# Altium schematic sheet Main.SchDoc
size A4; SheetNumber: 1; SheetTotal: 2
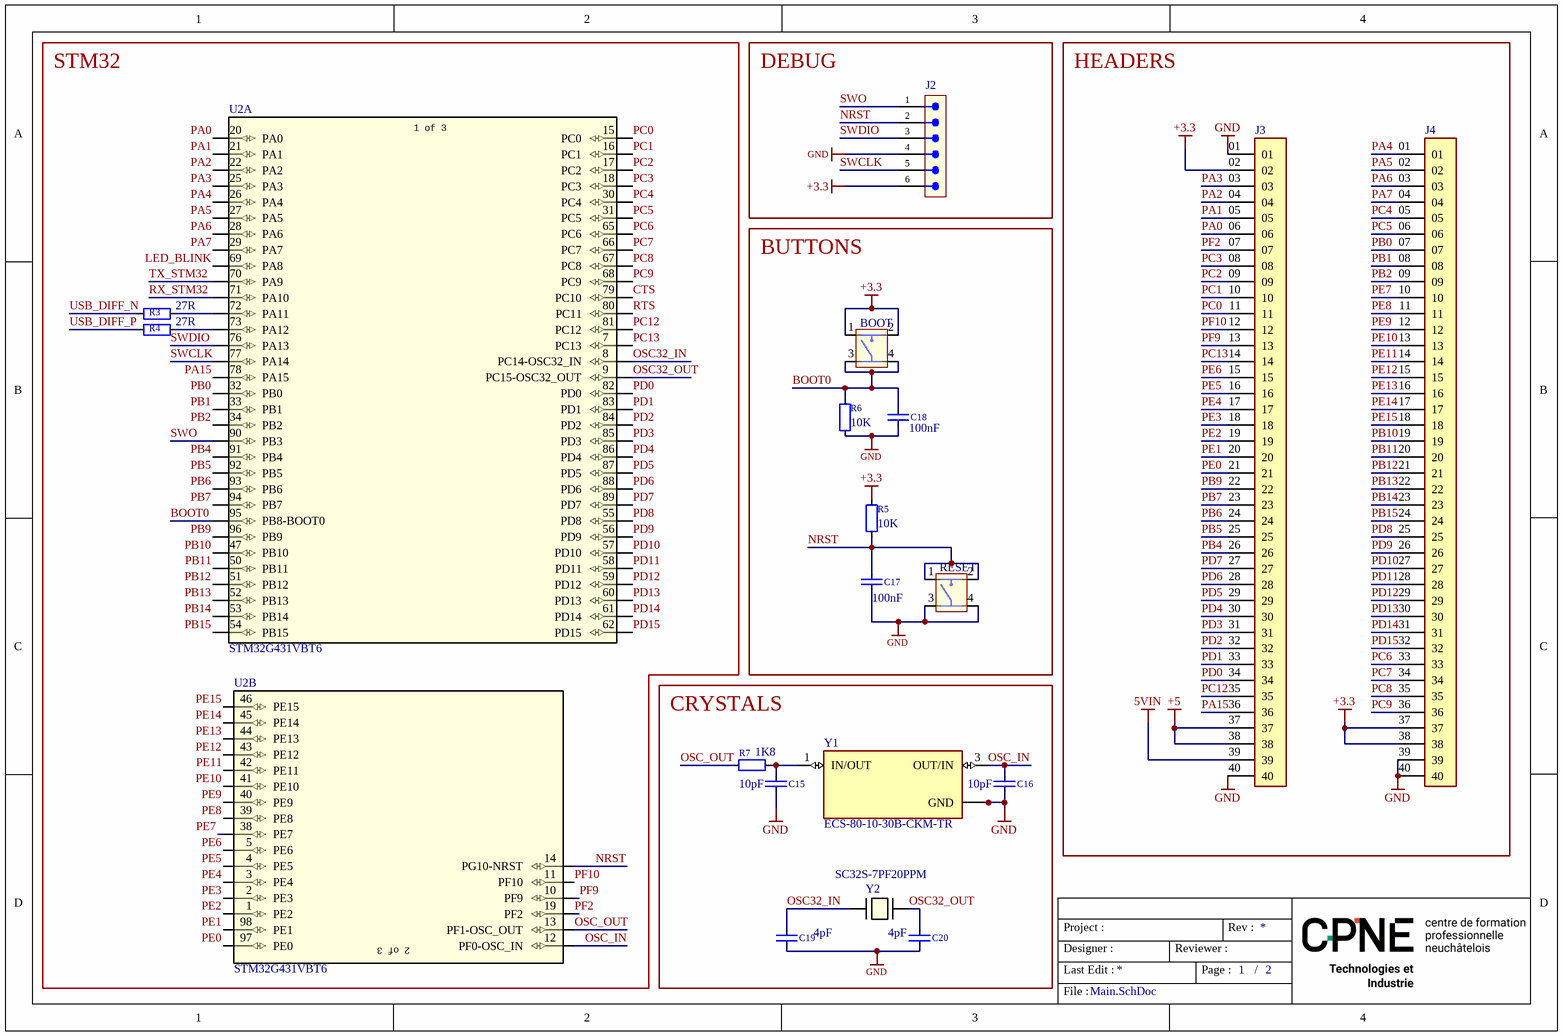
[diagram p0: Main.SchDoc]

## Parts
BOOT  PTS645SH43SMTR92 LFS  [PTS645SH43SMTR92 LFS]  (value not drawn)
C15  Displayed Value: 10pF  [WCAP-CSGP_0603_L1.6W0.8H0.8_Reflow]  (hidden comment: C_0603_10pF_50V)
C16  Displayed Value: 10pF  [WCAP-CSGP_0603_L1.6W0.8H0.8_Reflow]  (hidden comment: C_0603_10pF_50V)
C17  Displayed Value: 100nF  [SMD_0805_footprint]  (hidden comment: C_0805_100n0_X7R)
C18  Displayed Value: 100nF  [SMD_0805_footprint]  (hidden comment: C_0805_100n0_X7R)
C19  Displayed Value: 4pF  [WCAP-CSGP_0603_L1.6W0.8H0.8_Reflow]  (hidden comment: C_0603_4pF_50V)
C20  Displayed Value: 4pF  [WCAP-CSGP_0603_L1.6W0.8H0.8_Reflow]  (hidden comment: C_0603_4pF_50V)
J2  THT 1-Row Vertical Pin Header, 6 Pins, Pitch 2.54mm  [61300611121]  (value not drawn)
J3  THT 1-Row Vertical Pin Header, 40 Pins, Pitch 2.54mm  [THT 1-Row Vertical Pin Header, 40 Pins, Pitch 2.54mm]  (value not drawn)
J4  THT 1-Row Vertical Pin Header, 40 Pins, Pitch 2.54mm  [THT 1-Row Vertical Pin Header, 40 Pins, Pitch 2.54mm]  (value not drawn)
R3  Displayed Value: 27R  [SMD_0805_footprint]  (hidden comment: R_0805_27R0)
R4  Displayed Value: 27R  [SMD_0805_footprint]  (hidden comment: R_0805_27R0)
R5  Displayed Value: 10K  [SMD_0805_footprint]  (hidden comment: R_0805_10K_0.125W)
R6  Displayed Value: 10K  [SMD_0805_footprint]  (hidden comment: R_0805_10K_0.125W)
R7  Displayed Value: 1K8  [SMD_0805_footprint]  (hidden comment: R_0805_1K80)
RESET  PTS645SH43SMTR92 LFS  [PTS645SH43SMTR92 LFS]  (value not drawn)
U2  STM32G431VBT6  [LQFP100]  (parts A,B of 3)
Y1  ECS-80-10-30B-CKM-TR  [ECS-80-10-30B-CKM-TR]
Y2  SC32S-7PF20PPM  [SC32S-7PF20PPM-Footprint-1]

## Blocks framed on the sheet
STM32: R3 R4 U2
DEBUG: J2
HEADERS: J3 J4
BUTTONS: BOOT C17 C18 R5 R6 RESET
CRYSTALS: C15 C16 C19 C20 R7 Y1 Y2

## Nets
5VIN: J3.39
+3.3: BOOT.1 BOOT.2 J2.6 J3.02 J4.37 J4.38 R5.2
+5: J3.37 J3.38
GND: C15.1 C16.1 C17.1 C18.1 C19.1 C20.1 J2.4 J3.01 J3.40 J4.39 J4.40 R6.1 RESET.3 RESET.4 Y1.2(GND) Y1.4(GND)
BOOT0: BOOT.3 BOOT.4 C18.2 R6.2 U2.95(PB8-BOOT0)
CTS: U2.79(PC10)
LED_BLINK: U2.69(PA8)
NRST: C17.2 J2.2 R5.1 RESET.1 RESET.2 U2.14(PG10-NRST)
OSC32_IN: C19.2 U2.8(PC14-OSC32_IN) Y2.1
OSC32_OUT: C20.2 U2.9(PC15-OSC32_OUT) Y2.2
OSC_IN: C16.2 U2.12(PF0-OSC_IN) Y1.3(OUT/IN)
OSC_OUT: R7.1 U2.13(PF1-OSC_OUT)
PA0: J3.06 U2.20(PA0)
PA1: J3.05 U2.21(PA1)
PA2: J3.04 U2.22(PA2)
PA3: J3.03 U2.25(PA3)
PA4: J4.01 U2.26(PA4)
PA5: J4.02 U2.27(PA5)
PA6: J4.03 U2.28(PA6)
PA7: J4.04 U2.29(PA7)
PA15: J3.36 U2.78(PA15)
PB0: J4.07 U2.32(PB0)
PB1: J4.08 U2.33(PB1)
PB2: J4.09 U2.34(PB2)
PB4: J3.26 U2.91(PB4)
PB5: J3.25 U2.92(PB5)
PB6: J3.24 U2.93(PB6)
PB7: J3.23 U2.94(PB7)
PB9: J3.22 U2.96(PB9)
PB10: J4.19 U2.47(PB10)
PB11: J4.20 U2.50(PB11)
PB12: J4.21 U2.51(PB12)
PB13: J4.22 U2.52(PB13)
PB14: J4.23 U2.53(PB14)
PB15: J4.24 U2.54(PB15)
PC0: J3.11 U2.15(PC0)
PC1: J3.10 U2.16(PC1)
PC2: J3.09 U2.17(PC2)
PC3: J3.08 U2.18(PC3)
PC4: J4.05 U2.30(PC4)
PC5: J4.06 U2.31(PC5)
PC6: J4.33 U2.65(PC6)
PC7: J4.34 U2.66(PC7)
PC8: J4.35 U2.67(PC8)
PC9: J4.36 U2.68(PC9)
PC12: J3.35 U2.81(PC12)
PC13: J3.14 U2.7(PC13)
PD0: J3.34 U2.82(PD0)
PD1: J3.33 U2.83(PD1)
PD2: J3.32 U2.84(PD2)
PD3: J3.31 U2.85(PD3)
PD4: J3.30 U2.86(PD4)
PD5: J3.29 U2.87(PD5)
PD6: J3.28 U2.88(PD6)
PD7: J3.27 U2.89(PD7)
PD8: J4.25 U2.55(PD8)
PD9: J4.26 U2.56(PD9)
PD10: J4.27 U2.57(PD10)
PD11: J4.28 U2.58(PD11)
PD12: J4.29 U2.59(PD12)
PD13: J4.30 U2.60(PD13)
PD14: J4.31 U2.61(PD14)
PD15: J4.32 U2.62(PD15)
PE0: J3.21 U2.97(PE0)
PE1: J3.20 U2.98(PE1)
PE2: J3.19 U2.1(PE2)
PE3: J3.18 U2.2(PE3)
PE4: J3.17 U2.3(PE4)
PE5: J3.16 U2.4(PE5)
PE6: J3.15 U2.5(PE6)
PE7: J4.10 U2.38(PE7)
PE8: J4.11 U2.39(PE8)
PE9: J4.12 U2.40(PE9)
PE10: J4.13 U2.41(PE10)
PE11: J4.14 U2.42(PE11)
PE12: J4.15 U2.43(PE12)
PE13: J4.16 U2.44(PE13)
PE14: J4.17 U2.45(PE14)
PE15: J4.18 U2.46(PE15)
PF2: J3.07 U2.19(PF2)
PF9: J3.13 U2.10(PF9)
PF10: J3.12 U2.11(PF10)
RTS: U2.80(PC11)
RX_STM32: U2.71(PA10)
SWCLK: J2.5 U2.77(PA14)
SWDIO: J2.3 U2.76(PA13)
SWO: J2.1 U2.90(PB3)
TX_STM32: U2.70(PA9)
USB_DIFF_N: R3.1
USB_DIFF_P: R4.1
NetC15_2: C15.2 R7.2 Y1.1(IN/OUT)
NetR3_2: R3.2 U2.72(PA11)
NetR4_2: R4.2 U2.73(PA12)

## Notes on the sheet
- Designer :
- Last Edit :
- Project :
- Reviewer :
- Page :
- Rev :
- /
- File :
- (in symbol CMP-00274-1, part A) 1 of 3
- (in symbol CMP-00274-1, part B) 2 of 3

## Library data of the parts
BOOT RESET = CMP-00294-6: SWITCH TACTILE SPST-NO 0.05A 12V; Manufacturer: E-Switch; Manufacturer Part Number: TL3301NF160QG-KR; Datasheet: chrome-extension://efaidnbmnnnibpcajpcglclefindmkaj/https://configured-product-images.s3.amazonaws.com/Datasheets/TL3301.pdf
C15 C16 = C_0603_-1: CAP CER 10PF 50V C0G/NP0 0603 / 10 pF ±5% 50V Ceramic Capacitor C0G, NP0 0603 (1608 Metric); Manufacturer Part Number: C0603C100J5GACTU; Manufacturer: Kemet
C17 C18 = CMP-00043-7: Ceramic Capacitor, Multilayer, Ceramic, 50V, 10% +Tol, 10% -Tol, X7R, 15% TC, 0.1uF, Surface Mount, 0805; Manufacturer Part Number: 885012207098; Manufacturer: Würth Elektronik
C19 C20 = CMP-00285-1: CAP CER 4PF 50V C0G/NP0 0603 / 10 pF ±5% 50V Ceramic Capacitor C0G, NP0 0603 (1608 Metric); Manufacturer Part Number: CC0603CRNPO9BN4R0; Manufacturer: Yageo
J2 = CMP-00286-1: THT Vertical Pin Header WR-PHD, Pitch 2.54mm, Single Row, 6 Pins; Manufacturer: Würth Elektronik; Manufacturer Part Number: 613 006 11121
J3 J4 = CMP-00295-3: THT Vertical Pin Header WR-PHD, Pitch 2.54mm, Single Row, 40 Pins; Manufacturer: Würth Elektronik; Manufacturer Part Number: 613 008 11121
R3 R4 = CMP-001-001-2: Res Thick Film 0805 27 Ohm 1% 0.125W ±100ppm/°C Molded SMD Punched Carrier T/R; Manufacturer Part Number: CRCW080527R0JNTA; Manufacturer: Panasonic
R5 R6 = CMP-067-000001-3: Res Thick Film 0805 10K Ohm 1% 0.125W(1/8W) ±100ppm/C Pad SMD Automotive T/R; Manufacturer Part Number: ERJ-6ENF1002V; Manufacturer: Panasonic
R7 = CMP-00088-2: Resistor 1K8, SMD 0805, 1% 0.125W; Manufacturer: Panasonic; Manufacturer Part Number: ERJ-6ENF1801V
U2 = CMP-00274-1: Microcontroller 32-Bit ARM Cortex-M4 RISC 128KB Flash 1.71V to 3.6V 100-Pin LQFP; Number of USART Channels: 3; Peripherals: POR; Operating Supply Voltage: 3V; Number of Interrupts: 16; Interface: UART, USB; Number of I/Os: 6; Number of Channels: 23; DAC Channels (Resolution): 4-Ch 12-Bit; ADC Channels (Resolution): 23-Ch 12-Bit; RAM Size: 32kB; Frequency: 170MHz; Number of D/A Converters: 2; Number of UART Channels: 1; Clock Frequency: 48MHz; EEPROM Memory Size: 0B; Max Supply Current: 29mA; Number of Timers/Counters: 12; Memory Format: FLASH; Width: 14mm; Height - Seated (Max): 1.6mm; Lifecycle Status: Production; Number of Terminals: 100; Case/Package: LFQFP; Export Control Classification Number (ECCN) Code: 3A991.A.2; Introduction Date: 2019-10-29; Number of SPI Channels: 3; Min Operating Temperature: -40°C; China RoHS: Compliant; Max Supply Voltage: 3.6V; Country of Origin: Mainland China, Malaysia, Philippines, Taiwan; Min Supply Voltage: 1.71V; Number of A/D Converters: 2; Length: 14mm; RoHS: Compliant; Harmonized Tariff Schedule (HTS) Code: 8542.31.00.25; REACH SVHC: Yes; Terminal Pitch: 500µm; Max Operating Temperature: 85°C; Core Architecture: ARM Cortex-M4; Number of I2C Channels: 3; Flash Memory Size: 128kB
Y1 = CMP-00281-2: Crystal, Standard, 8 MHz, SMD, 5mm x 3.2mm x 0.85mm, 10 ppm, 10 pF, 10 ppm, ECX-53B; Load Capacitance: 10pF; Frequency Tolerance: 0.001%; Frequency Stability: 10ppm; ESR: 100Ω; Frequency: 8MHz; Lifecycle Status: Production; Min Operating Temperature: -20°C; RoHS: Compliant; REACH SVHC: Yes; Max Operating Temperature: 70°C; Country of Origin: South Korea, Taiwan; Mounting Technology: Surface Mount; Introduction Date: 2018-05-11
Y2 = CMP-00293-1: Crystal 0.032768MHz ±20ppm (Tol) 7pF FUND 70000Ohm 2-Pin SMD T/R; ESR (Equivalent Series Resistance): 70kΩ; Frequency Tolerance: 0.002%; Frequency: 32.768kHz; Max Operating Temperature: 85°C; Case/Package: SMD/SMT; Value: 7pF; Length: 3.2004mm; Width: 1.4986mm; Schedule B: 8541600025, 8541600025; Packaging: Tape & Reel (TR); Load Capacitance: 7pF; Mounting Technology: Surface Mount; Min Operating Temperature: -40°C; Height: 838.2µm; RoHS: Compliant